# EAGLE design V_driver_4 (EAGLE 5.11)
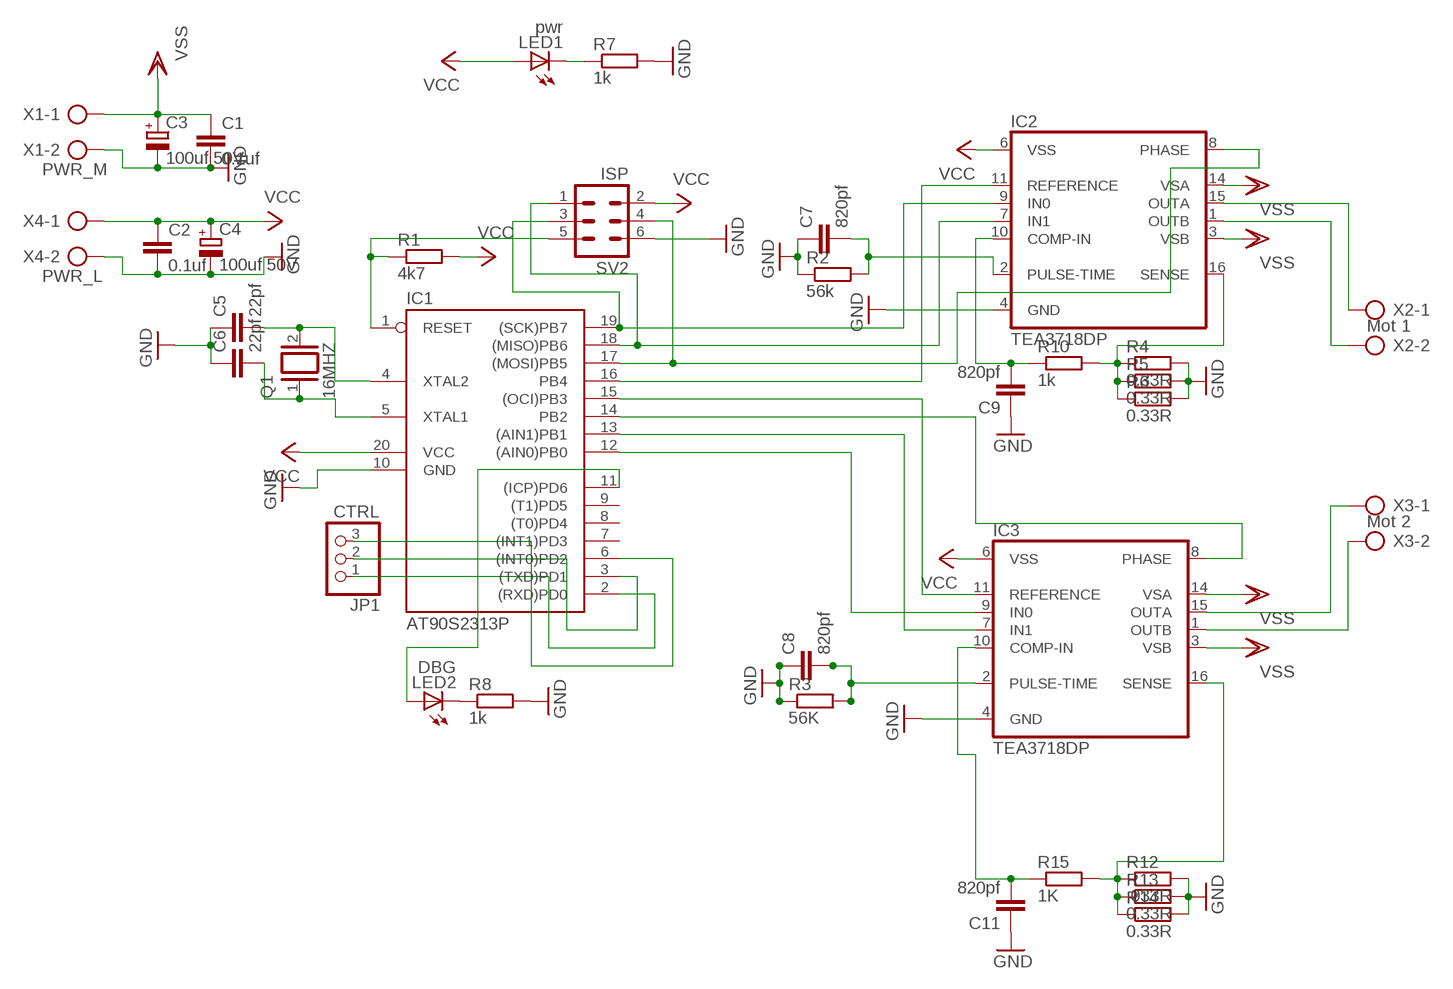
[diagram p0: schematic, sheet 1]

## Parts
C1  0.1uf  C-EU025-030X050  [C025-030X050]
C2  0.1uf  C-EU025-030X050  [C025-030X050]
C3  100uf 50V  CPOL-EUE3.5-8  [E3,5-8]
C4  100uf 50V  CPOL-EUE3.5-8  [E3,5-8]
C5  22pf  C-EU025-030X050  [C025-030X050]
C6  22pf  C-EU025-030X050  [C025-030X050]
C7  820pf  C-EU025-030X050  [C025-030X050]
C8  820pf  C-EU025-030X050  [C025-030X050]
C9  820pf  C-EU025-030X050  [C025-030X050]
C11  820pf  C-EU025-030X050  [C025-030X050]
IC1  AT90S2313P  [DIL20]
IC2  TEA3718DP  [DIL16]
IC3  TEA3718DP  [DIL16]
JP1  CTRL  PINHD-1X3  [1X03]
LED1  pwr  LED3MM  [LED3MM]
LED2  DBG  LED3MM  [LED3MM]
Q1  16MHZ  XTAL/S  [QS]
R1  4k7  R-EU_0204/5  [0204/5]
R2  56k  R-EU_0204/5  [0204/5]
R3  56K  R-EU_0204/5  [0204/5]
R4  0.33R  R-EU_0207/10  [0207/10]
R5  0.33R  R-EU_0207/10  [0207/10]
R6  0.33R  R-EU_0207/10  [0207/10]
R7  1k  R-EU_0204/5  [0204/5]
R8  1k  R-EU_0204/5  [0204/5]
R10  1k  R-EU_0204/5  [0204/5]
R12  .033R  R-EU_0207/10  [0207/10]
R13  0.33R  R-EU_0207/10  [0207/10]
R14  0.33R  R-EU_0207/10  [0207/10]
R15  1K  R-EU_0204/5  [0204/5]
SV2  ISP  MA03-2  [MA03-2]
X1  PWR_M  AK500/2  [AK500/2]
X2  Mot 1  AK500/2  [AK500/2]
X3  Mot 2  AK500/2  [AK500/2]
X4  PWR_L  AK500/2  [AK500/2]

## Nets
GND: C1.2 C2.2 C3.- C4.- C5.1 C6.1 C7.1 C8.1 C9.1 C11.1 IC1.10(GND) IC2.4(GND) IC3.4(GND) R2.1 R3.1 R4.2 R5.2 R6.2 R7.2 R8.2 R12.2 R13.2 R14.2 SV2.6 X1.2 X4.2
N$1: LED1.K(C) R7.1
N$2: C9.2 IC2.10(COMP-IN) R10.1
N$3: IC2.16(SENSE) R4.1 R5.1 R6.1 R10.2
N$4: C5.2 IC1.4(XTAL2) Q1.2
N$5: C6.2 IC1.5(XTAL1) Q1.1
N$6: LED2.K(C) R8.1
N$7: IC1.1(RESET) R1.1 SV2.5
N$8: IC2.15(OUTA) X2.1
N$9: IC2.1(OUTB) X2.2
N$10: IC3.15(OUTA) X3.1
N$11: IC3.1(OUTB) X3.2
N$12: IC1.18((MISO)PB6) IC2.7(IN1) SV2.1
N$13: IC1.19((SCK)PB7) IC2.9(IN0) SV2.3
N$14: IC1.17((MOSI)PB5) IC2.8(PHASE) SV2.4
N$15: C11.2 IC3.10(COMP-IN) R15.1
N$16: IC1.15((OCI)PB3) IC3.11(REFERENCE)
N$17: IC1.16(PB4) IC2.11(REFERENCE)
N$18: IC1.14(PB2) IC3.8(PHASE)
N$19: IC1.13((AIN1)PB1) IC3.7(IN1)
N$20: IC1.12((AIN0)PB0) IC3.9(IN0)
N$24: C7.2 IC2.2(PULSE-TIME) R2.2
N$25: IC3.16(SENSE) R12.1 R13.1 R14.1 R15.2
N$26: C8.2 IC3.2(PULSE-TIME) R3.2
N$27: IC1.11((ICP)PD6) LED2.A
N$28: IC1.2((RXD)PD0) JP1.1
N$29: IC1.3((TXD)PD1) JP1.2
N$30: IC1.6((INT0)PD2) JP1.3
VCC: C2.1 C4.+ IC1.20(VCC) IC2.6(VSS) IC3.6(VSS) LED1.A R1.2 SV2.2 X4.1
VSS: C1.1 C3.+ IC2.3(VSB) IC2.14(VSA) IC3.3(VSB) IC3.14(VSA) X1.1
Unconnected: IC1.7((INT1)PD3) IC1.8((T0)PD4) IC1.9((T1)PD5)

## Power pins joined to a net without a drawn wire
GND: IC2.5(GND) IC2.12(GND) IC2.13(GND) IC3.5(GND) IC3.12(GND) IC3.13(GND)

## Library data of the parts
C1 C2 C5-C9 C11 = rcl:C-EU: CAPACITOR, European symbol
C3 C4 = rcl:CPOL-EU: POLARIZED CAPACITOR, European symbol
IC1 = atmel:AT90S2313: MICROCONTROLLER 2 Kbytes FLASH 128 bytes SRAM 128 bytes EEPROM UART
IC2 IC3 = st-microelectronics:TEA3718*D: STEPPER MOTOR DRIVER
JP1 = pinhead:PINHD-1X3: PIN HEADER
LED1 LED2 = led:LED: LED OSRAM: - CHIPLED LG R971, LG N971, LY N971, LG Q971, LY Q971, LO R971, LY R971 LH N974, LH R974 LS Q976, LO Q976, LY Q976 LO Q996 - Hyper CHIPLED LW Q18S LB Q993, LB Q99A, LB R99A - SideLED LS A670, LO A670, LY A670, LG A670, LP A670 LB A673, LV A673, LT A673, LW A673 LH A674 LY A675 LS A676, LA A676, LO A676, LY A676, LW A676 LS A679, LY A679, LG A679 - Hyper Micro SIDELED® LS Y876, LA Y876, LO Y876, LY Y876 LT Y87S - SmartLED LW L88C, LW L88S LB L89C, LB L89S, LG L890 LS L89K, LO L89K, LY L89K LS L896, LA L896, LO L896, LY L896 - TOPLED LS T670, LO T670, LY T670, LG T670, LP T670 LSG T670, LSP T670, LSY T670, LOP T670, LYG T670 LG T671, LOG T671, LSG T671 LB T673, LV T673, LT T673, LW T673 LH T674 LS T676, LA T676, LO T676, LY T676, LB T676, LH T676, LSB T676, LW T676 LB T67C, LV T67C, LT T67C, LS T67K, LO T67K, LY T67K, LW E67C LS E67B, LA E67B, LO E67B, LY E67B, LB E67C, LV E67C, LT E67C LW T67C LS T679, LY T679, LG T679 LS T770, LO T770, LY T770, LG T770, LP T770 LB T773, LV T773, LT T773, LW T773 LH T774 LS E675, LA E675, LY E675, LS T675 LS T776, LA T776, LO T776, LY T776, LB T776 LHGB T686 LT T68C, LB T68C - Hyper Mini TOPLED® LB M676 - Mini TOPLED Santana® LG M470 LS M47K, LO M47K, LY M47K Source: http://www.osram.convergy.de LUXEON: - LUMILED® LXK2-PW12-R00, LXK2-PW12-S00, LXK2-PW14-U00, LXK2-PW14-V00 LXK2-PM12-R00, LXK2-PM12-S00, LXK2-PM14-U00 LXK2-PE12-Q00, LXK2-PE12-R00, LXK2-PE12-S00, LXK2-PE14-T00, LXK2-PE14-U00 LXK2-PB12-K00, LXK2-PB12-L00, LXK2-PB12-M00, LXK2-PB14-N00, LXK2-PB14-P00, LXK2-PB14-Q00 LXK2-PR12-L00, LXK2-PR12-M00, LXK2-PR14-Q00, LXK2-PR14-R00 LXK2-PD12-Q00, LXK2-PD12-R00, LXK2-PD12-S00 LXK2-PH12-R00, LXK2-PH12-S00 LXK2-PL12-P00, LXK2-PL12-Q00, LXK2-PL12-R00 Source: www.luxeon.com KINGBRIGHT: KA-3528ASYC Source: www.kingbright.com
Q1 = special:XTAL/S: CRYSTAL
R1-R8 R10 R12-R15 = rcl:R-EU_: RESISTOR, European symbol
SV2 = con-lstb:MA03-2: PIN HEADER
X1-X4 = con-ptr500:AK500/2: CONNECTOR

## Board
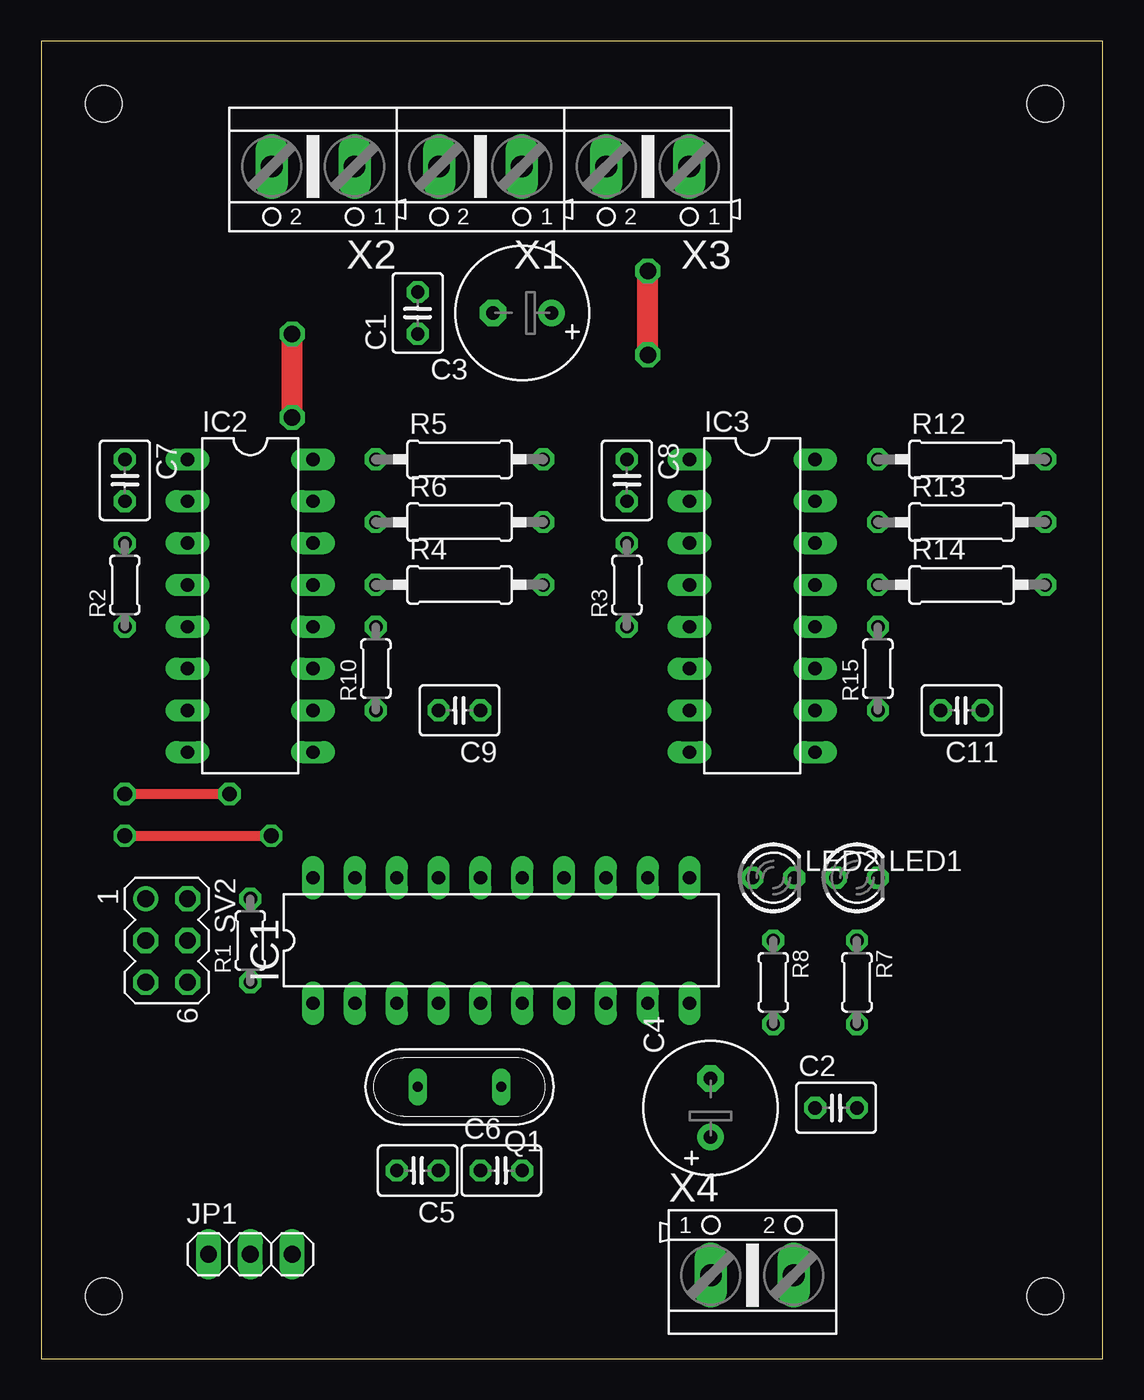
[diagram p1: board, top side]
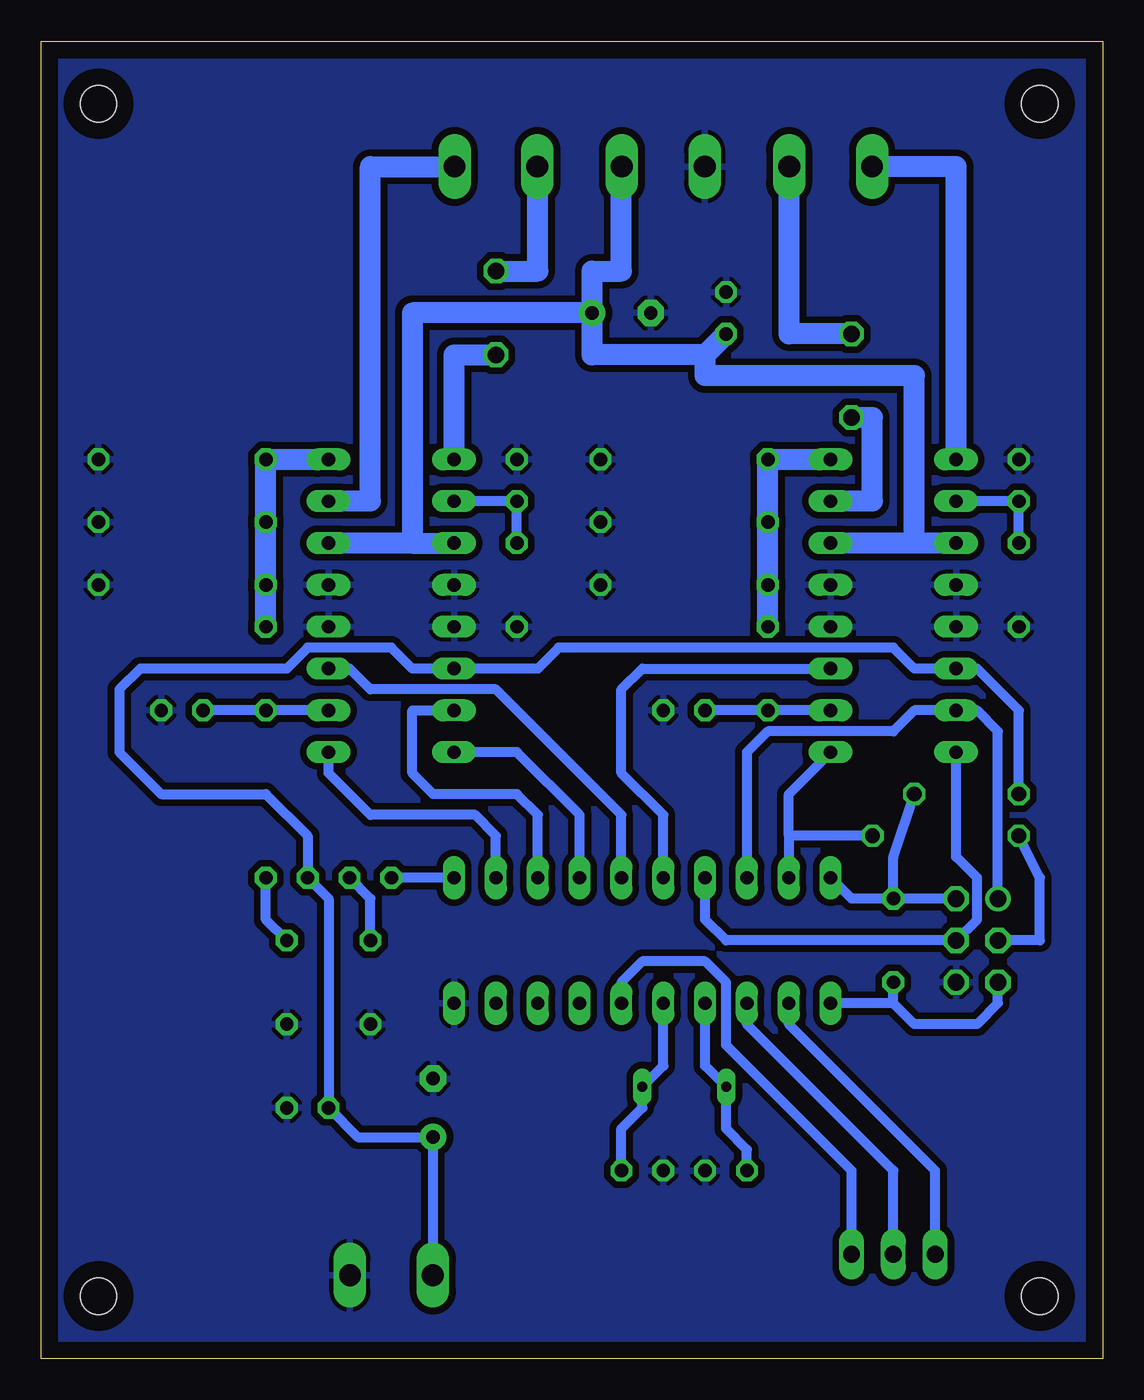
[diagram p2: board, bottom side, seen from below]

Size 64.44 x 80 mm. Coordinates in mm from the lower left corner, seen from the top.
Outline: 0,0 64.44,0 64.44,80 0,80 0,0
Copper layers (1*16): Top 0.035mm / dielectric 1.5mm / Bottom 0.035mm
Design rules "default": minimum track width 10mil, minimum drill 24mil, track to track 8mil, track to pad 8mil, pad to pad 8mil, via to via 8mil, smd to smd 8mil, copper to edge 40mil, drill to drill 8mil, minimum pad ring 10mil, minimum via ring 8mil, stop-mask expansion 4mil, vias tented up to drill 0mil, thermal gap 10mil
Holes 2.2 mm at 3.81,76.2 60.96,76.2 3.81,3.81 60.96,3.81

### Footprints (pad centres in the part's own frame; a part is rotated, then mirrored left to right if it is on the bottom)
C025-030X050 = drill 0.813 octagon: 1 -1.27,0; 2 1.27,0
E3,5-8 = drill 0.813 pad 1.6 round: + -1.778,0 | drill 0.813 pad 1.6 octagon: - 1.778,0
DIL20 = drill 0.813 long: 1 -11.43,-3.81; 2 -8.89,-3.81; 3 -6.35,-3.81; 4 -3.81,-3.81; 5 -1.27,-3.81; 6 1.27,-3.81; 7 3.81,-3.81; 8 6.35,-3.81; 9 8.89,-3.81; 10 11.43,-3.81; 11 11.43,3.81; 12 8.89,3.81; 13 6.35,3.81; 14 3.81,3.81; 15 1.27,3.81; 16 -1.27,3.81; 17 -3.81,3.81; 18 -6.35,3.81; 19 -8.89,3.81; 20 -11.43,3.81
DIL16 = drill 0.813 long: 1 -8.89,-3.81; 2 -6.35,-3.81; 3 -3.81,-3.81; 4 -1.27,-3.81; 5 1.27,-3.81; 6 3.81,-3.81; 7 6.35,-3.81; 8 8.89,-3.81; 9 8.89,3.81; 10 6.35,3.81; 11 3.81,3.81; 12 1.27,3.81; 13 -1.27,3.81; 14 -3.81,3.81; 15 -6.35,3.81; 16 -8.89,3.81
1X03 = drill 1.016 long: 1 -2.54,0; 2 0,0; 3 2.54,0
LED3MM = drill 0.813 octagon: A -1.27,0; K 1.27,0
QS = drill 0.61 long: 1 -2.54,0; 2 2.54,0
0204/5 = drill 0.813 octagon: 1 -2.54,0; 2 2.54,0
0207/10 = drill 0.813 octagon: 1 -5.08,0; 2 5.08,0
MA03-2 = drill 1.016 round: 1 -2.54,-1.27 | drill 1.016 octagon: 2 -2.54,1.27; 3 0,-1.27; 4 0,1.27; 5 2.54,-1.27; 6 2.54,1.27
AK500/2 = drill 1.321 long: 1 -2.515,0; 2 2.515,0

### Placement (x,y rotation side)
C1  22.86,63.5 90 top
C2  48.26,15.24 0 top
C3  29.21,63.5 180 top
C4  40.64,15.24 90 top
C5  22.86,11.43 180 top
C6  27.94,11.43 0 top
C7  5.08,53.34 270 top
C8  35.56,53.34 270 top
C9  25.4,39.37 180 top
C11  55.88,39.37 180 top
IC1  27.94,25.4 0 top
IC2  12.7,45.72 270 top
IC3  43.18,45.72 270 top
JP1  12.7,6.35 0 top
LED1  49.53,29.21 0 top
LED2  44.45,29.21 0 top
Q1  25.4,16.51 180 top
R1  12.7,25.4 90 top
R2  5.08,46.99 90 top
R3  35.56,46.99 90 top
R4  25.4,46.99 0 top
R5  25.4,54.61 0 top
R6  25.4,50.8 0 top
R7  49.53,22.86 270 top
R8  44.45,22.86 270 top
R10  20.32,41.91 90 top
R12  55.88,54.61 0 top
R13  55.88,50.8 0 top
R14  55.88,46.99 0 top
R15  50.8,41.91 90 top
SV2  7.62,25.4 270 top
X1  26.67,72.39 180 top
X2  16.51,72.39 180 top
X3  36.83,72.39 180 top
X4  43.18,5.08 0 top

### Tracks (layer width: path | path; a pad name or v marks a point on that pad's centre or on a via)
GND
  pour Bottom (isolate 0.406): 0,78.74 64.77,78.74 64.77,-1.27 0,-1.27
N$1
  Bottom 0.61: LED1.K 50.8,26.67 R7.1
N$2
  Bottom 0.61: IC2.10 R10.1 C9.2
N$3
  Bottom 1.27: IC2.16 R5.1 R6.1 R4.1 R10.2
N$4
  Bottom 0.61: IC1.4 24.13,17.78 Q1.2 22.86,13.97 21.59,12.7 C5.2
N$5
  Bottom 0.61: IC1.5 26.67,17.78 Q1.1 27.94,15.24 29.21,13.97 C6.2
N$6
  Bottom 0.61: LED2.K 44.45,27.94 R8.1
N$7
  Bottom 0.61: 12.7,21.59 R1.1 | 12.7,21.59 11.43,20.32 7.62,20.32 6.35,21.59 SV2.5 | 12.7,21.59 IC1.1
N$8  (via drill 1)
  Top 1.27: v15.24,57.15 v15.24,62.23
  Bottom 1.27: IC2.15 13.97,52.07 13.97,57.15 v15.24,57.15 | v15.24,62.23 19.02,62.23 X2.1
N$9
  Bottom 1.27: X2.2 8.89,72.39 IC2.1
N$10
  Bottom 1.27: X3.1 44.45,72.39 44.45,52.07 IC3.15
N$11  (via drill 1)
  Top 1.27: v36.83,60.96 v36.83,66.04
  Bottom 1.27: X3.2 34.29,72.39 34.29,66.04 v36.83,66.04 | v36.83,60.96 39.37,60.96 IC3.1
N$12
  Bottom 0.61: IC1.18 21.59,36.83 20.32,38.1 12.7,38.1 11.43,39.37 IC2.7 7.62,39.37 6.35,38.1 SV2.1
N$13  (via drill 0.9)
  Top 0.61: v5.08,31.75 v13.97,31.75
  Bottom 0.61: IC2.9 19.05,34.29 19.05,31.75 | 19.05,31.75 IC1.19 | SV2.3 3.81,25.4 3.81,29.21 v5.08,31.75 | v13.97,31.75 19.05,31.75
N$14
  Bottom 0.61: IC1.17 24.13,26.67 22.86,25.4 SV2.4 7.62,26.67 7.62,29.21 8.89,30.48 IC2.8
N$15
  Bottom 0.61: IC3.10 R15.1 C11.2
N$16
  Bottom 0.61: IC3.11 45.72,41.91 44.45,40.64 36.83,40.64 29.21,33.02 IC1.15
N$17
  Bottom 0.61: IC2.11 27.94,41.91 29.21,40.64 29.21,35.56 26.67,33.02 IC1.16
N$18
  Bottom 0.61: IC1.14 31.75,33.02 35.56,36.83 IC3.8
N$19
  Bottom 0.61: IC1.13 34.29,33.02 35.56,34.29 40.64,34.29 41.91,35.56 41.91,39.37 IC3.7
N$20
  Bottom 0.61: IC3.9 46.99,35.56 44.45,33.02 38.1,33.02 36.83,31.75 IC1.12
N$24
  Bottom 0.61: R2.2 C7.2 IC2.2
N$25
  Bottom 1.27: IC3.16 R12.1 R13.1 R14.1 R15.2
N$26
  Bottom 0.61: R3.2 C8.2 IC3.2
N$27
  Bottom 0.61: IC1.11 LED2.A
N$28
  Bottom 0.61: IC1.2 19.05,20.32 10.16,11.43 JP1.1
N$29
  Bottom 0.61: IC1.3 21.59,20.32 12.7,11.43 JP1.2
N$30
  Bottom 0.61: IC1.6 29.21,22.86 27.94,24.13 24.13,24.13 22.86,22.86 22.86,19.05 15.24,11.43 JP1.3
VCC  (via drill 0.9)
  Top 0.61: v11.43,34.29 v5.08,34.29
  Bottom 0.61: SV2.2 R1.2 | R1.2 15.24,27.94 IC1.20 | v5.08,34.29 5.08,39.37 7.62,41.91 IC2.6 11.43,41.91 12.7,43.18 33.02,43.18 34.29,41.91 IC3.6 41.91,41.91 43.18,43.18 48.26,43.18 49.53,41.91 58.42,41.91 59.69,40.64 59.69,36.83 57.15,34.29 50.8,34.29 48.26,31.75 LED1.A 46.99,27.94 C2.1 45.21,13.46 C4.+ 40.66,13.44 X4.1 | v11.43,34.29 12.7,30.48 R1.2
VSS
  Bottom 1.27: IC2.3 11.43,49.53 | 11.43,49.53 IC2.14 | 41.91,49.53 IC3.3 | 41.91,49.53 IC3.14 | C3.+ 41.91,63.5 41.91,49.53 | 24.13,60.96 24.13,59.69 11.43,59.69 11.43,49.53 | 24.13,60.96 C1.1 | 24.13,60.96 30.99,60.96 C3.+ | X1.1 29.21,72.39 29.21,66.04 30.99,66.04 C3.+